# Altium schematic sheet 1-Half_Bridge.SchDoc
size A4
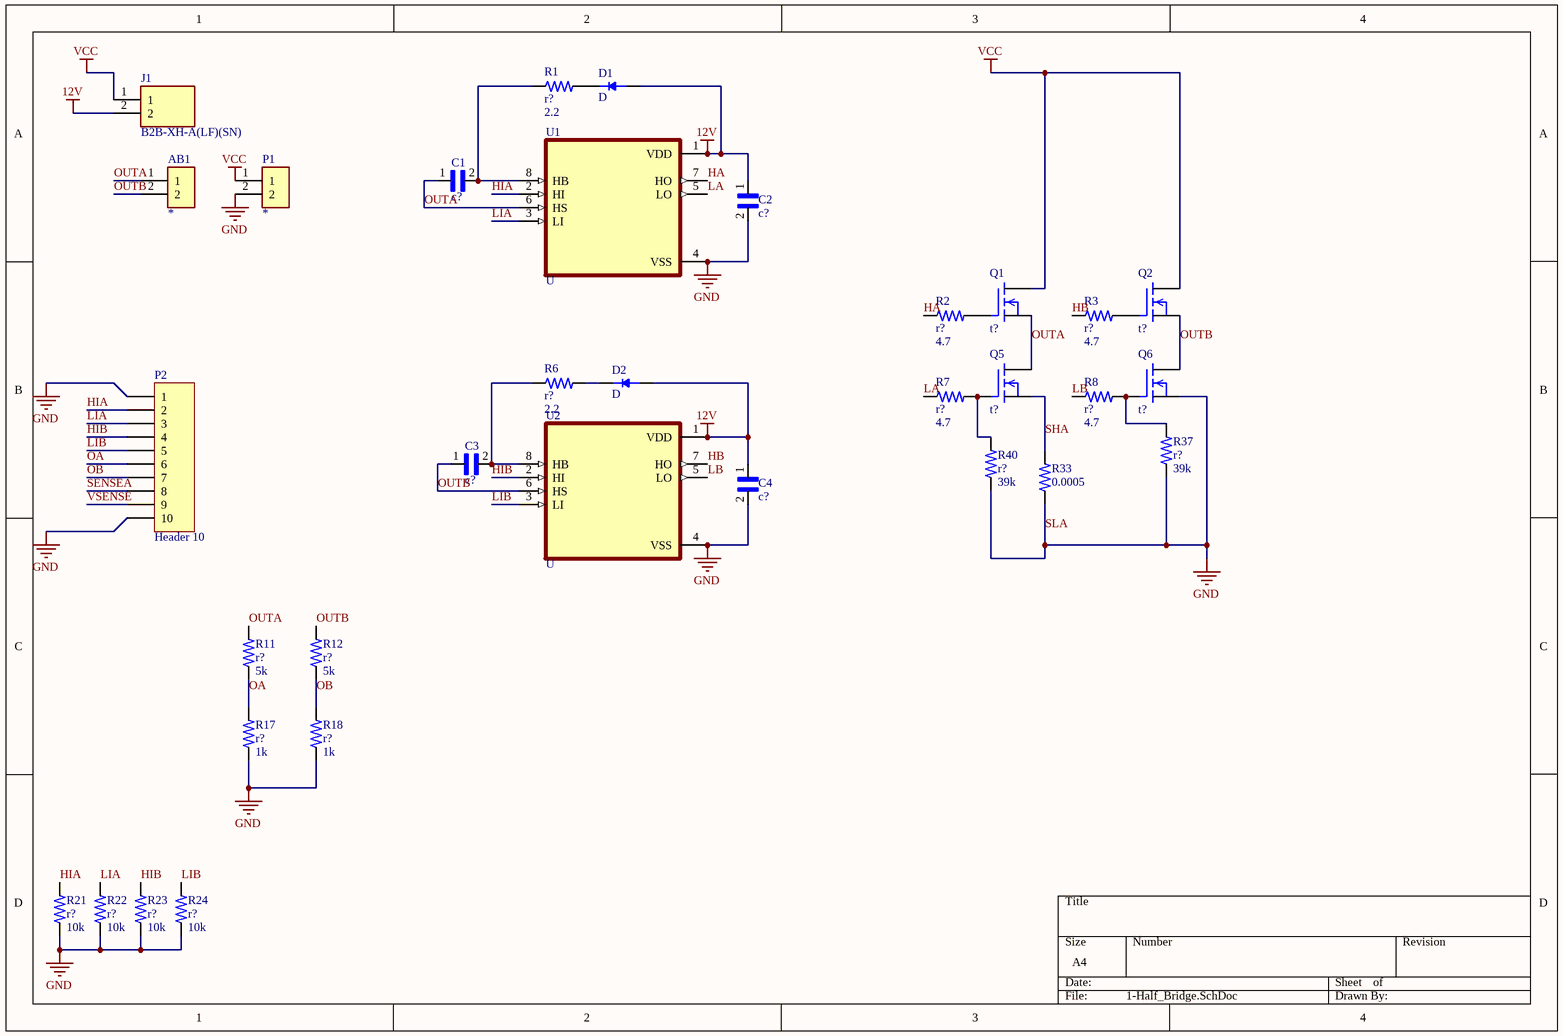
[diagram p0: 1-Half_Bridge.SchDoc]

## Parts
AB1  282837-2  [terminal]  (value not drawn)
C1  c?  [cap 1206]
C2  c?  [cap 1206]
C3  c?  [cap 1206]
C4  c?  [cap 1206]
D1  D  [do 214]
D2  D  [do 214]
J1  B2B-XH-A(LF)(SN)  [JST_B2B-XH-A(LF)(SN)]
P1  282837-2  [terminal]  (value not drawn)
P2  Header 10  [HDR1X10]
Q1  t?  [TO-263AB]
Q2  t?  [TO-263AB]
Q5  t?  [TO-263AB]
Q6  t?  [TO-263AB]
R1  r?  value 2.2  [RES-0805]
R2  r?  value 4.7  [RES-0805]
R3  r?  value 4.7  [RES-0805]
R6  r?  value 2.2  [RES-0805]
R7  r?  value 4.7  [RES-0805]
R8  r?  value 4.7  [RES-0805]
R11  r?  value 5k  [RES-0805]
R12  r?  value 5k  [RES-0805]
R17  r?  value 1k  [RES-0805]
R18  r?  value 1k  [RES-0805]
R21  r?  value 10k  [RES-0805]
R22  r?  value 10k  [RES-0805]
R23  r?  value 10k  [RES-0805]
R24  r?  value 10k  [RES-0805]
R33  value 0.0005  [2512]  (hidden comment: 1-1879378-6)
R37  r?  value 39k  [RES-0805]
R40  r?  value 39k  [RES-0805]
U1  U  [SOIC 8N]
U2  U  [SOIC 8N]

## Nets
12V: C2.1 C4.1 D1.A D2.A J1.2 U1.1(VDD) U2.1(VDD)
SLA: C2.2 C4.2 P1.2 P2.1 P2.10 Q6.1(SRC) R17.1 R18.1 R21.1 R22.1 R23.1 R24.1 R33.1 R37.1 R40.1 U1.4(VSS) U2.4(VSS)  [also labelled GND]
VCC: J1.1 P1.1 Q1.3(DRN) Q2.3(DRN)
HA: R2.1 U1.7(HO)
HB: R3.1 U2.7(HO)
HIA: P2.2 R21.2 U1.2(HI)
HIB: P2.4 R23.2 U2.2(HI)
LA: R7.1 U1.5(LO)
LB: R8.1 U2.5(LO)
LIA: P2.3 R22.2 U1.3(LI)
LIB: P2.5 R24.2 U2.3(LI)
OA: P2.6 R11.1 R17.2
OB: P2.7 R12.1 R18.2
OUTA: AB1.1 C1.1 Q1.1(SRC) Q5.3(DRN) R11.2 U1.6(HS)
OUTB: AB1.2 C3.1 Q2.1(SRC) Q6.3(DRN) R12.2 U2.6(HS)
SENSEA: P2.8
SHA: Q5.1(SRC) R33.2
VSENSE: P2.9
NetC1_2: C1.2 R1.1 U1.8(HB)
NetC3_2: C3.2 R6.1 U2.8(HB)
NetD1_C: D1.C R1.2
NetD2_C: D2.C R6.2
NetQ1_2: Q1.2(GATE) R2.2
NetQ2_2: Q2.2(GATE) R3.2
NetQ5_2: Q5.2(GATE) R7.2 R40.2
NetQ6_2: Q6.2(GATE) R8.2 R37.2

## Library data of the parts
AB1 P1 = terminal 2: Connector Terminal Blocks Receptacle 2 Position 5.08mm Solder Straight Thru-Hole 13.5A/Contact; MF: TE Connectivity; Digi-Key_Purchase_URL: https://www.digikey.in/product-detail/en/te-connectivity-amp-connectors/282837-2/A113320-ND/2187973?utm_source=snapeda&utm_medium=aggregator&utm_campaign=symbol; Value: *; TE_purchase_URL: https://www.te.com/usa-en/product-282837-2.html?te_bu=Cor&te_type=disp&te_campaign=seda_glo_cor-seda-global-disp-prtnr-fy19-seda-model-bom-cta_sma-317_1&elqCampaignId=32493; Package: None; MP: 282837-2; SnapEDA_Link: https://www.snapeda.com/parts/282837-2/TE%20Connectivity%20AMP%20Connectors/view-part/2549980/?ref=snap; Digi-Key_Part_Number: A113320-ND; Comment_1: *
C1 C3 = Cap 1206: Film Capacitor; Value: 1uf; MP: CB018B0103JBA; MF: AVX; Price: None; Package: 1206 AVX; Availability: Unavailable; SnapEDA_Link: https://www.snapeda.com/parts/CB018B0103JBA/AVX/view-part/2283023/?ref=snap
C2 C4 = Cap 1206: Film Capacitor; Value: 10uf; MP: CB018B0103JBA; MF: AVX; Price: None; Package: 1206 AVX; Availability: Unavailable; SnapEDA_Link: https://www.snapeda.com/parts/CB018B0103JBA/AVX/view-part/2283023/?ref=snap
D1 D2 = mura110: Diode Schottky 30V 100mA Surface Mount GMD2; MP: RB520ZS-30T2R; MF: Rohm; SnapEDA_Link: https://www.snapeda.com/parts/RB520ZS-30T2R/Rohm/view-part/119018/?ref=snap; DigiKey-Purchase-URL: https://snapeda.com/shop?store=DigiKey&id=119018; Package: 0201 Rohm; Availability: Warning; Price: None; Mouser-Purchase-URL: https://snapeda.com/shop?store=Mouser&id=119018; Value: *
J1 = B2B-XH-A(LF)(SN): Connector Header Through Hole 2 position 0.098 _2.50mm_; MP: B2B-XH-A_LF__SN_; MF: JST Sales; Price: None; Package: None; Value: *; Availability: Unavailable; SnapEDA_Link: https://www.snapeda.com/parts/B2B-XH-A%28LF%29%28SN%29/JST%20Sales%20America%20Inc./view-part/492310/?ref=snap
P2 = Header 10: Header, 10-Pin; LatestRevisionDate: 17-Jul-2002; LatestRevisionNote: Re-released for DXP Platform.; Publisher: Altium Limited
Q1 Q2 Q5 Q6 = n-mos: N-Channel 60V 200mA _Ta_ 350mW _Tc_ Through Hole TO-92-3; MF: ON Semiconductor; MP: 2N7000G; Digi-Key_Purchase_URL: https://www.digikey.ca/product-detail/en/on-semiconductor/2N7000G/2N7000GOS-ND/1475375?utm_source=snapeda&utm_medium=aggregator&utm_campaign=symbol; Value: *; Package: TO-92 Rochester Electronics; SnapEDA_Link: https://www.snapeda.com/parts/2N7000G/ON%20Semiconductor/view-part/820965/?ref=snap; Digi-Key_Part_Number: 2N7000GOS-ND
R1-R3 R6-R8 R11 R12 R17 R18 R21-R24 R37 R40 = Res-0805: Res, Thin Film, 16r5, 0.1%, 0.25w, 0805; MP: RP73PF2A16R5BTDF; MF: TE Connectivity; SnapEDA_Link: https://www.snapeda.com/parts/RP73PF2A16R5BTDF/TE%20Connectivity/view-part/1047398/?ref=snap; Package: 0805 TE Connectivity; Availability: Unavailable; Price: None
R33 = RES-2512: TLR 2512 2.0W R006 1% 50PPM 2K RL; Power_Rating: 2 W; MP: TLR3A20DR006FTDG; Resistance: .006; MF: TE Connectivity; Availability: Warning; Package: 2512; DigiKey-Purchase-URL: https://snapeda.com/shop?store=DigiKey&id=976058; Tolerance: 1%; EU_RoHS_Compliance: Compliant; SnapEDA_Link: https://www.snapeda.com/parts/TLR3A20DR006FTDG/TE%20Connectivity%20Passive%20Product/view-part/976058/?ref=snap; Price: None
U1 U2 = LM5109BMA: 1-A, 100-V half bridge gate driver with 8-V UVLO and high noise immunity 8-SOIC -40 to 125; MF: Texas Instruments; Price: None; Value: *; Availability: Warning; DigiKey-Purchase-URL: https://snapeda.com/shop?store=DigiKey&id=14856; SnapEDA_Link: https://www.snapeda.com/parts/LM5109BMA/Texas%20Instruments/view-part/14856/?ref=snap; MP: LM5109BMA; Package: SOIC-8 Texas Instruments